# Altium project LED_Chaser.PrjPcb
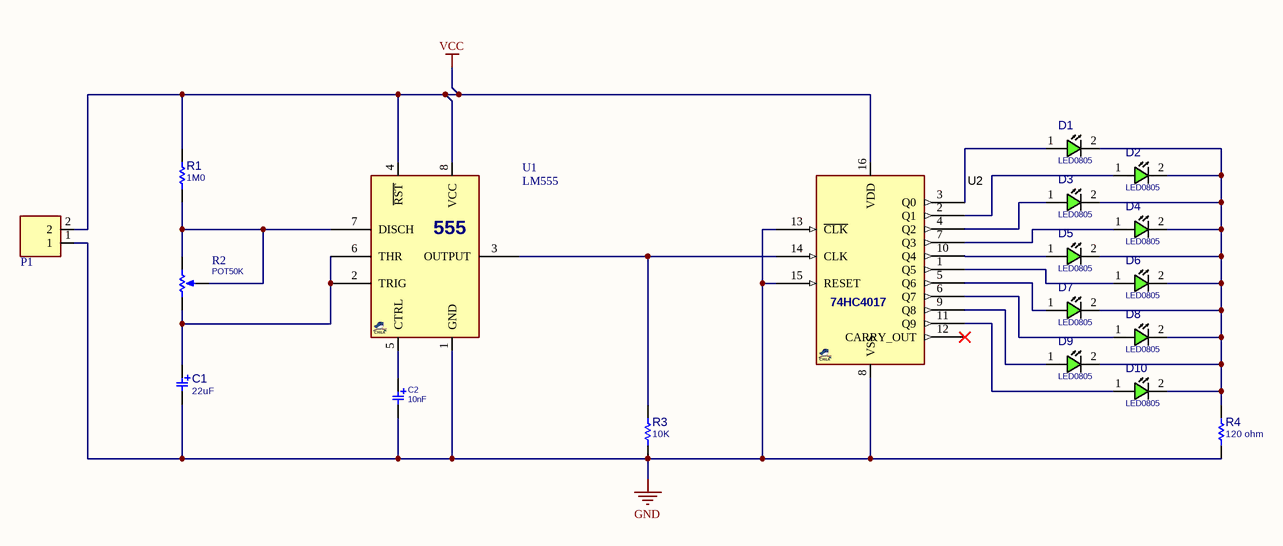
[diagram p0: Sheet1.SchDoc]
1 sheet, 19 parts. Net scope: global (net labels, ports and power ports of the same name join across sheets).
Board files: PCB1.PcbDoc, PCB2_Panel.PcbDoc

## Sheet Sheet1.SchDoc
size A3; SheetNumber: 1; SheetTotal: 1

### Parts
C1  22uF  [C_EL_D5L5]
C2  10nF  [C_TN_3528]
D1  LED0805  [LED0805]
D2  LED0805  [LED0805]
D3  LED0805  [LED0805]
D4  LED0805  [LED0805]
D5  LED0805  [LED0805]
D6  LED0805  [LED0805]
D7  LED0805  [LED0805]
D8  LED0805  [LED0805]
D9  LED0805  [LED0805]
D10  LED0805  [LED0805]
P1  CONN_PWL_2  [PWL_2]  (value not drawn)
R1  1M0  [R0805]
R2  POT50K  [POTS_V10MM]
R3  10K  [R0805]
R4  120 ohm  [R0805]
U1  LM555  [SO_8]
U2  74HC4017  [SO_16]  (value not drawn)

### Nets
GND: C1.2 C2.2 P1.1 R3.1 R4.1 U1.1(GND) U2.8(VSS) U2.13(~{CLK}) U2.15(RESET)
VCC: P1.2 R1.2 U1.4(~{RST}) U1.8(VCC) U2.16(VDD)
NetC1_1: C1.1 R2.1(TOP) U1.2(TRIG) U1.6(THR)
NetC2_1: C2.1 U1.5(CTRL)
NetD1_1: D1.1(ANODE) U2.3(Q0)
NetD1_2: D1.2(CATHODE) D2.2(CATHODE) D3.2(CATHODE) D4.2(CATHODE) D5.2(CATHODE) D6.2(CATHODE) D7.2(CATHODE) D8.2(CATHODE) D9.2(CATHODE) D10.2(CATHODE) R4.2
NetD2_1: D2.1(ANODE) U2.2(Q1)
NetD3_1: D3.1(ANODE) U2.4(Q2)
NetD4_1: D4.1(ANODE) U2.7(Q3)
NetD5_1: D5.1(ANODE) U2.10(Q4)
NetD6_1: D6.1(ANODE) U2.1(Q5)
NetD7_1: D7.1(ANODE) U2.5(Q6)
NetD8_1: D8.1(ANODE) U2.6(Q7)
NetD9_1: D9.1(ANODE) U2.9(Q8)
NetD10_1: D10.1(ANODE) U2.11(Q9)
NetR1_1: R1.1 R2.2(TAP) R2.3(BOT) U1.7(DISCH)
NetR3_2: R3.2 U1.3(OUTPUT) U2.14(CLK)

Not connected (* = marked no-connect by the designer): U2 12(CARRY_OUT)*

### Notes on the sheet
- (in symbol LM555C_SOP8) 555

### Library data of the parts
C1 = CAP_SMD_EL: CAP, SMD, ELEC,; MANF_P#: MANF_PART#; PARAM2: -V; DESC: DESCRIPTION; DIST#: MOUSER; PARAM: 20%; PRICE: 10= -$; MANF: MANF; ASSEMBLY: ASSEMBLY; VALUE: 22uF
C2 = CAP_SMD_TAN: CAP, SMD, TAN; PARAM: 20%, 300mOhm, -55~105oC; MANF: VISHAY; MANF_P#: T55A106M6R3C0300; PARAM2: 6.3V; PRICE: 0.46$; VALUE: 10nF
D1-D10 = LED_SMD_0805: LED, SMD, 0805; DESC: DESCRIPTION; MANF_P#: MANF_PART#; PARAM2: 2.2V; MANF: MANF; ASSEMBLY: ASSEMBLY; PRICE: PRICE; VALUE: LED0805
P1 = CONN_PWL_2: Power Terminal 2pin,Header, 2-Pin; VALUE: CONN_PWL_2
R1 R3 R4 = RES_SMD_0805: RESISTOR, SMD; PARAM: -W; DESC: DESCRIPTION; DIST#: MOUSER; PARAM2: 1%; MANF_P#: -; MANF: -; ASSEMBLY: ASSEMBLY; PRICE: 100= 0.5$
  R1: VALUE: 1M0
  R3: VALUE: 10K
  R4: VALUE: 120 ohm
R2 = RES_SMD_POT_V10: RESISTOR, SMD, Potentiometer, 10mm; VALUE: POT50K
U1 = LM555C_SOP8: 555 Timer,; MANF: Texas Instruments; MANF_P#: LM555CMX, LMC555CM; PARAM2: 4.5~16V; PARAM: 200mA output, 0~70oC; VALUE: LM555
U2 = 74HC4017_SOP16: Counter, 10 decoded output; MANF: NXP, TI; MANF_P#: 74HC4017D, CD74HC4017M; PARAM2: 2~6V; PARAM: -55~125oC; PRICE: 0.5$; VALUE: 74HC4017